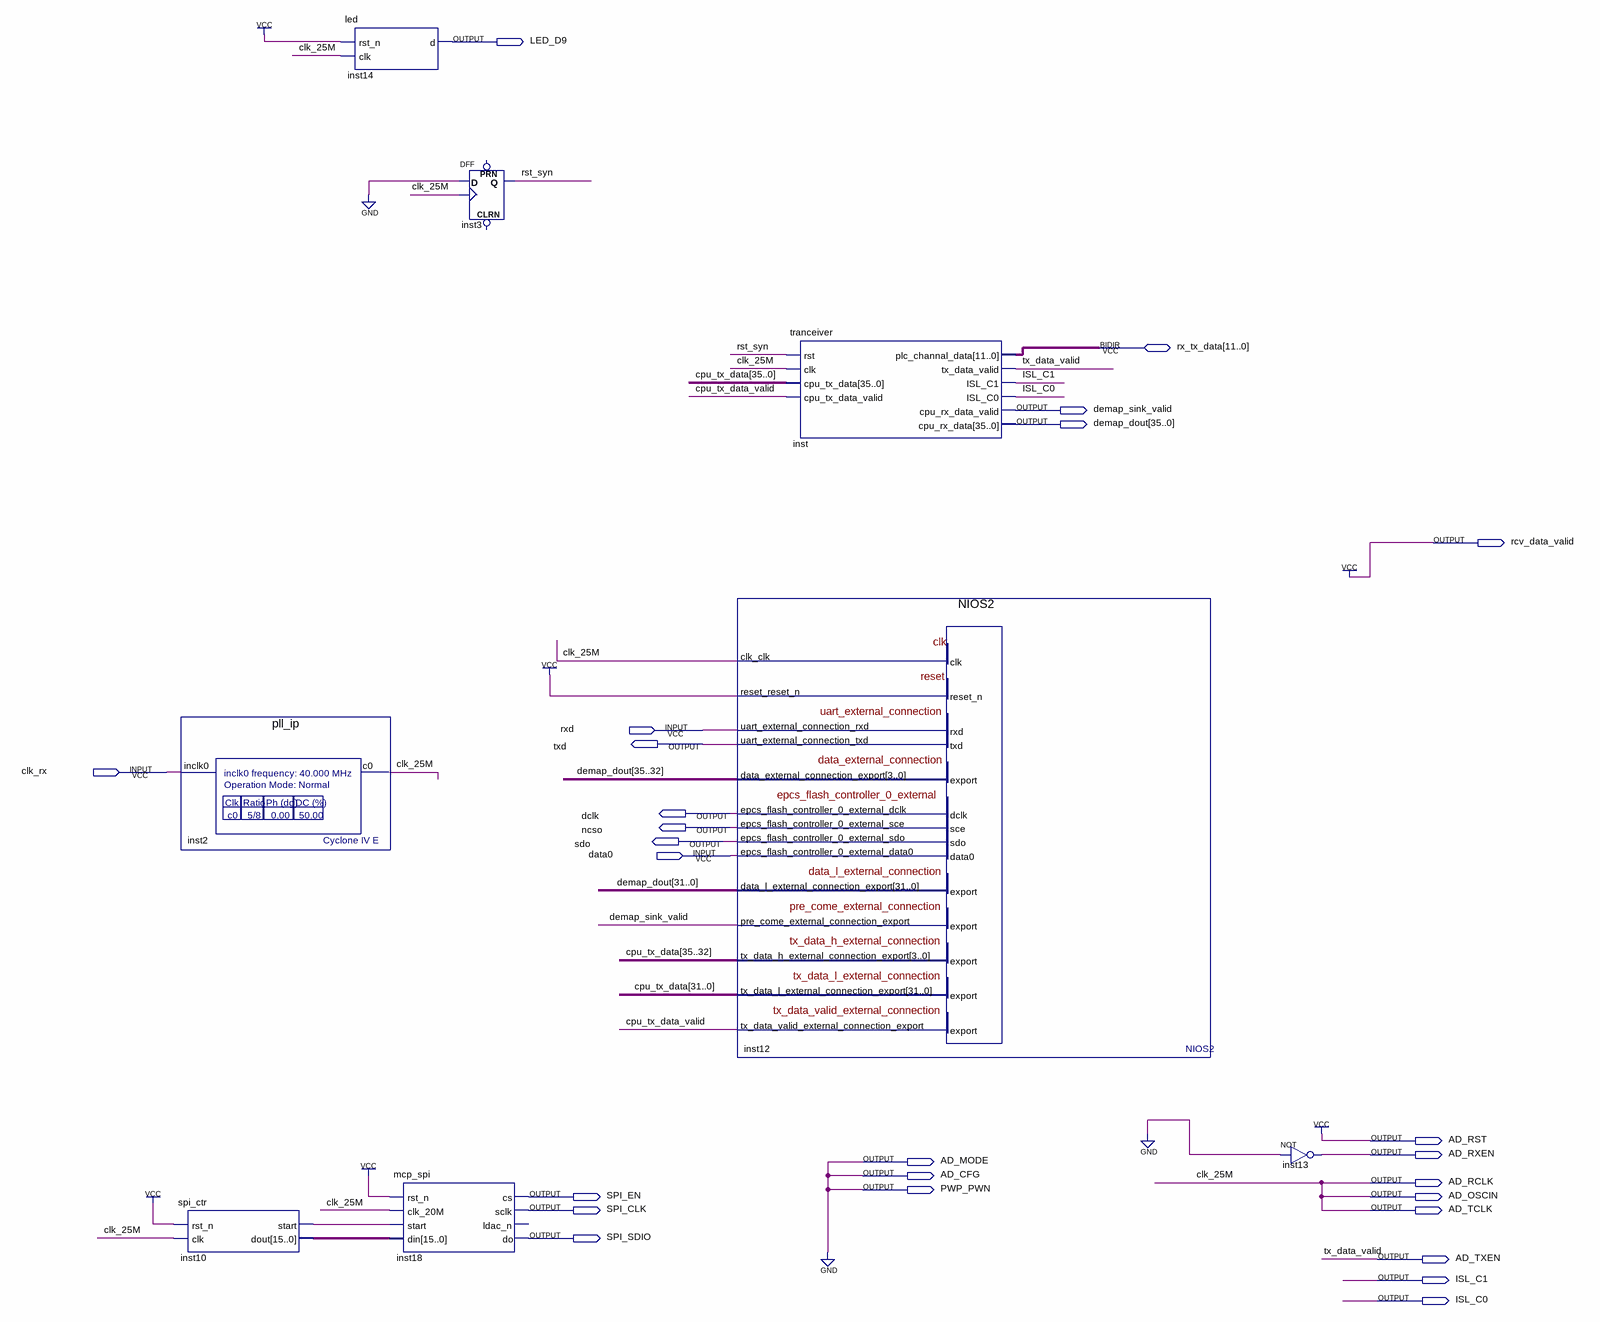
[diagram p0: schematic sheet]
// Quartus schematic plc_design.bdf as structural Verilog: 8 symbols, 26 pins
module plc_design (
  input  rxd,
  input  clk_rx,
  input  data0,
  inout  [11:0] rx_tx_data,
  output LED_D9,
  output demap_sink_valid,
  output [35:0] demap_dout,
  output rcv_data_valid,
  output txd,
  output dclk,
  output ncso,
  output sdo,
  output AD_RST,
  output AD_RXEN,
  output AD_MODE,
  output AD_CFG,
  output AD_RCLK,
  output PWP_PWN,
  output SPI_EN,
  output AD_OSCIN,
  output SPI_CLK,
  output AD_TCLK,
  output SPI_SDIO,
  output AD_TXEN,
  output ISL_C1,
  output ISL_C0
);

  wire cpu_tx_data_valid, inst10_start, rst_syn;
  wire [15:0] inst10_dout;
  wire [35:0] cpu_tx_data;

  pll_ip inst2 (.inclk0(clk_rx), .c0(AD_OSCIN));
  spi_ctr inst10 (.rst_n(1'b1), .clk(AD_OSCIN), .start(inst10_start), .dout(inst10_dout));
  led inst14 (.rst_n(1'b1), .clk(AD_OSCIN), .d(LED_D9));
  mcp_spi inst18 (
    .rst_n(1'b1), .clk_20M(AD_OSCIN), .start(inst10_start), .din(inst10_dout), .cs(SPI_EN), .sclk(SPI_CLK),
    .\do (SPI_SDIO));  // open: ldac_n
  DFF inst3 (.CLK(AD_OSCIN), .D(1'b0), .Q(rst_syn));  // open: CLRN, PRN
  NIOS2 inst12 (
    .clk_clk(AD_OSCIN), .reset_reset_n(1'b1), .uart_external_connection_rxd(rxd),
    .data_external_connection_export(demap_dout[35:32]), .epcs_flash_controller_0_external_data0(data0),
    .data_l_external_connection_export(demap_dout[31:0]),
    .pre_come_external_connection_export(demap_sink_valid), .uart_external_connection_txd(txd),
    .epcs_flash_controller_0_external_dclk(dclk), .epcs_flash_controller_0_external_sce(ncso),
    .epcs_flash_controller_0_external_sdo(sdo), .tx_data_h_external_connection_export(cpu_tx_data[35:32]),
    .tx_data_l_external_connection_export(cpu_tx_data[31:0]),
    .tx_data_valid_external_connection_export(cpu_tx_data_valid));
  tranceiver inst (
    .rst(rst_syn), .clk(AD_OSCIN), .cpu_tx_data(cpu_tx_data), .cpu_tx_data_valid(cpu_tx_data_valid),
    .tx_data_valid(AD_TXEN), .ISL_C1(ISL_C1), .ISL_C0(ISL_C0), .cpu_rx_data_valid(demap_sink_valid),
    .cpu_rx_data(demap_dout), .plc_channal_data(rx_tx_data));
  not inst13 (AD_RXEN, 1'b0);

  assign AD_CFG = 1'b0;
  assign AD_MODE = 1'b0;
  assign AD_RCLK = AD_OSCIN;
  assign AD_RST = 1'b1;
  assign AD_TCLK = AD_OSCIN;
  assign PWP_PWN = 1'b0;
  assign rcv_data_valid = 1'b1;

  // Other names for the same wires on the sheet: clk_25M = AD_OSCIN; tx_data_valid = AD_TXEN
endmodule
